# EAGLE schematic neckmed-3 (EAGLE 9.6.2)
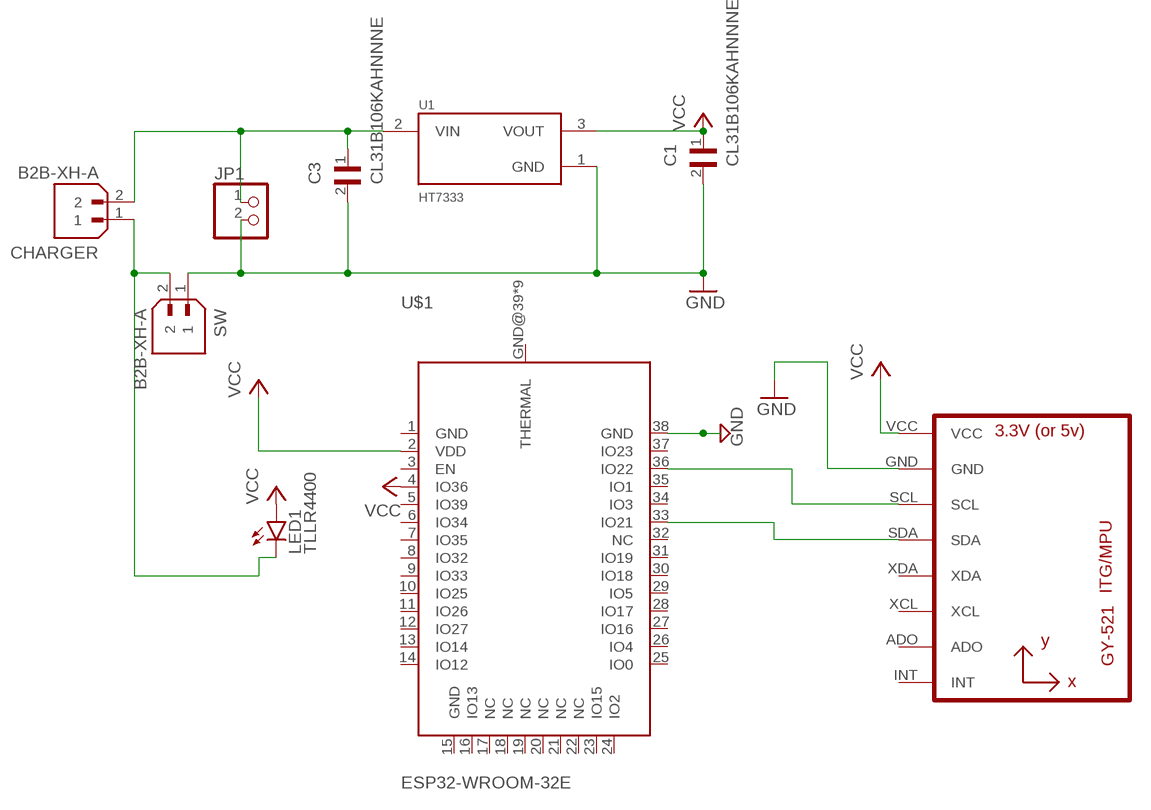
[diagram p0: schematic, sheet 1]

## Parts
C1  CL31B106KAHNNNE  [CAPC3216X180N]
C3  CL31B106KAHNNNE  [CAPC3216X180N]
CHARGER  B2B-XH-A  [JST_B2B-XH-A]
JP1  PINHD-1X2  [1X02]
LED1  TLLR4400  [LED3MM]
SW  B2B-XH-A  [JST_B2B-XH-A]
U1  HT7333  [IC_HT7333]
U2  GY-521MPU6050  [GY-521]
U$1  ESP32-WROOM-32E  [ESP32-WROOM-32E]

## Nets
GND: C1.2 C3.2 JP1.2 SW.1 U1.1(GND) U2.GND U$1.38(GND)
N$1: C3.1 CHARGER.2 JP1.1 U1.2(VIN)
N$2: CHARGER.1 LED1.K(C) SW.2
N$8: U2.SCL U$1.36(IO22)
N$9: U2.SDA U$1.33(IO21)
VCC: C1.1 LED1.A U1.3(VOUT) U2.VCC U$1.2(VDD) U$1.4(IO36)
Unconnected: U2.ADO U2.INT U2.XCL U2.XDA U$1.1(GND) U$1.3(EN) U$1.5(IO39) U$1.6(IO34) U$1.7(IO35) U$1.8(IO32) U$1.9(IO33) U$1.10(IO25) U$1.11(IO26) U$1.12(IO27) U$1.13(IO14) U$1.14(IO12) U$1.15(GND) U$1.16(IO13) U$1.17(NC) U$1.18(NC) U$1.19(NC) U$1.20(NC) U$1.21(NC) U$1.22(NC) U$1.23(IO15) U$1.24(IO2) U$1.25(IO0) U$1.26(IO4) U$1.27(IO16) U$1.28(IO17) U$1.29(IO5) U$1.30(IO18) U$1.31(IO19) U$1.32(NC) U$1.34(IO3) U$1.35(IO1) U$1.37(IO23) U$1.GND@39(THERMAL) U$1.GND@40(THERMAL) U$1.GND@41(THERMAL) U$1.GND@42(THERMAL) U$1.GND@43(THERMAL) U$1.GND@44(THERMAL) U$1.GND@45(THERMAL) U$1.GND@46(THERMAL) U$1.GND@47(THERMAL)

## Library data of the parts
C1 C3 = CL31B106KAHNNNE:CL31B106KAHNNNE: Cap Ceramic 10uF 25V X7R 10% Pad SMD 1206 125°C T/R Check availability <https://pricing.snapeda.com/parts/CL31B106KAHNNNE/Samsung%20Electro-Mechanics/view-part?ref=eda>; AVAILABILITY: In Stock; CHECK_PRICES: https://www.snapeda.com/parts/CL31B106KAHNNNE/Samsung+Electro-Mechanics/view-part/?ref=eda; DESCRIPTION: CL31 Series 10 uF 25 V ±10 % Tolerance X7R SMT Multilayer Ceramic Capacitor; MF: Samsung Electro-Mechanics; MP: CL31B106KAHNNNE; PACKAGE: 1206 Samsung; PRICE: None; PURCHASE-URL: https://www.snapeda.com/api/url_track_click_mouser/?unipart_id=570537&manufacturer=Samsung Electro-Mechanics&part_name=CL31B106KAHNNNE&search_term=capacitor smd 1206 samsung cl31; SNAPEDA_LINK: https://www.snapeda.com/parts/CL31B106KAHNNNE/Samsung+Electro-Mechanics/view-part/?ref=snap
CHARGER SW = B2B-XH-A:B2B-XH-A: Check availability <https://pricing.snapeda.com/parts/B2B-XH-A/JST%20Sales/view-part?ref=eda>; AVAILABILITY: In Stock; CHECK_PRICES: https://www.snapeda.com/parts/B2B-XH-A/JST+Sales+America+Inc./view-part/?ref=eda; DESCRIPTION: Connector Header Through Hole 2 position 0.098 (2.50mm); MF: JST Sales; MP: B2B-XH-A; PACKAGE: None; PRICE: None; PURCHASE-URL: https://www.snapeda.com/api/url_track_click_mouser/?unipart_id=552747&manufacturer=JST Sales&part_name=B2B-XH-A&search_term=jwt xh; SNAPEDA_LINK: https://www.snapeda.com/parts/B2B-XH-A/JST+Sales+America+Inc./view-part/?ref=snap
JP1 = pinhead:PINHD-1X2: PIN HEADER
LED1 = led:TLLR4400: Low Current (2mA) LED 3 mm Tinted Diffused Package color RED Source: Data sheet <http://www.farnell.com/datasheets/391100.pdf>; MF: VISHAY SEMICONDUCTOR; OC_FARNELL: 1612437
U1 = HT7333:HT7333: Check availability <https://pricing.snapeda.com/parts/HT7333/Holtek%20Semiconductor/view-part?ref=eda>; AVAILABILITY: Not in stock; CHECK_PRICES: https://www.snapeda.com/parts/HT7333/Holtek/view-part/?ref=eda; DESCRIPTION: Three-terminal, low power, high voltage regulator implemented in CMOS technology; MF: Holtek Semiconductor; MP: HT7333; PACKAGE: None; PRICE: None; SNAPEDA_LINK: https://www.snapeda.com/parts/HT7333/Holtek/view-part/?ref=snap
U2 = GY-521:GY-521: Check availability <https://pricing.snapeda.com/parts/GY-521/GODREAM%20FORDREAM%20CO.%2C%20LIMITED/view-part?ref=eda>; AVAILABILITY: Not in stock; CHECK_PRICES: https://www.snapeda.com/parts/GY-521/GODREAM+FORDREAM+CO.%252C+LIMITED/view-part/?ref=eda; DESCRIPTION: Triple Axis Accelerometer Gyro Breakout; MF: GODREAM FORDREAM CO., LIMITED; MP: GY-521; PACKAGE: Package; PRICE: None; SNAPEDA_LINK: https://www.snapeda.com/parts/GY-521/GODREAM+FORDREAM+CO.%252C+LIMITED/view-part/?ref=snap
U$1 = ESP32-WROOM-32E:ESP32-WROOM-32E: Check availability <https://pricing.snapeda.com/parts/ESP32-WROOM-32E/Espressif%20Systems/view-part?ref=eda>; AVAILABILITY: In Stock; CHECK_PRICES: https://www.snapeda.com/parts/ESP32-WROOM-32E/Espressif+Systems/view-part/?ref=eda; DESCRIPTION: RX TXRX MOD WIFI TRACE ANT SMD; MF: Espressif Systems; MP: ESP32-WROOM-32E; PACKAGE: SMD-44 Espressif Systems; PRICE: None; SNAPEDA_LINK: https://www.snapeda.com/parts/ESP32-WROOM-32E/Espressif+Systems/view-part/?ref=snap